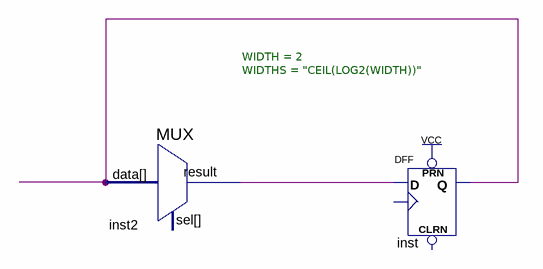
[diagram p0: schematic sheet]
// Quartus schematic step1.bdf as structural Verilog: 2 symbols, 0 pins
module step1 (
);

  wire inst2_result, inst_q;

  MUX #(.WIDTH(2), .WIDTHS("CEIL(LOG2(WIDTH))")) inst2 (.data({2{inst_q}}), .result(inst2_result));  // open: sel
  DFF inst (.D(inst2_result), .PRN(1'b1), .Q(inst_q));  // open: CLRN, CLK
endmodule
